# Altium schematic sheet DFP.SchDoc
size B; SheetNumber: 5; SheetTotal: 8
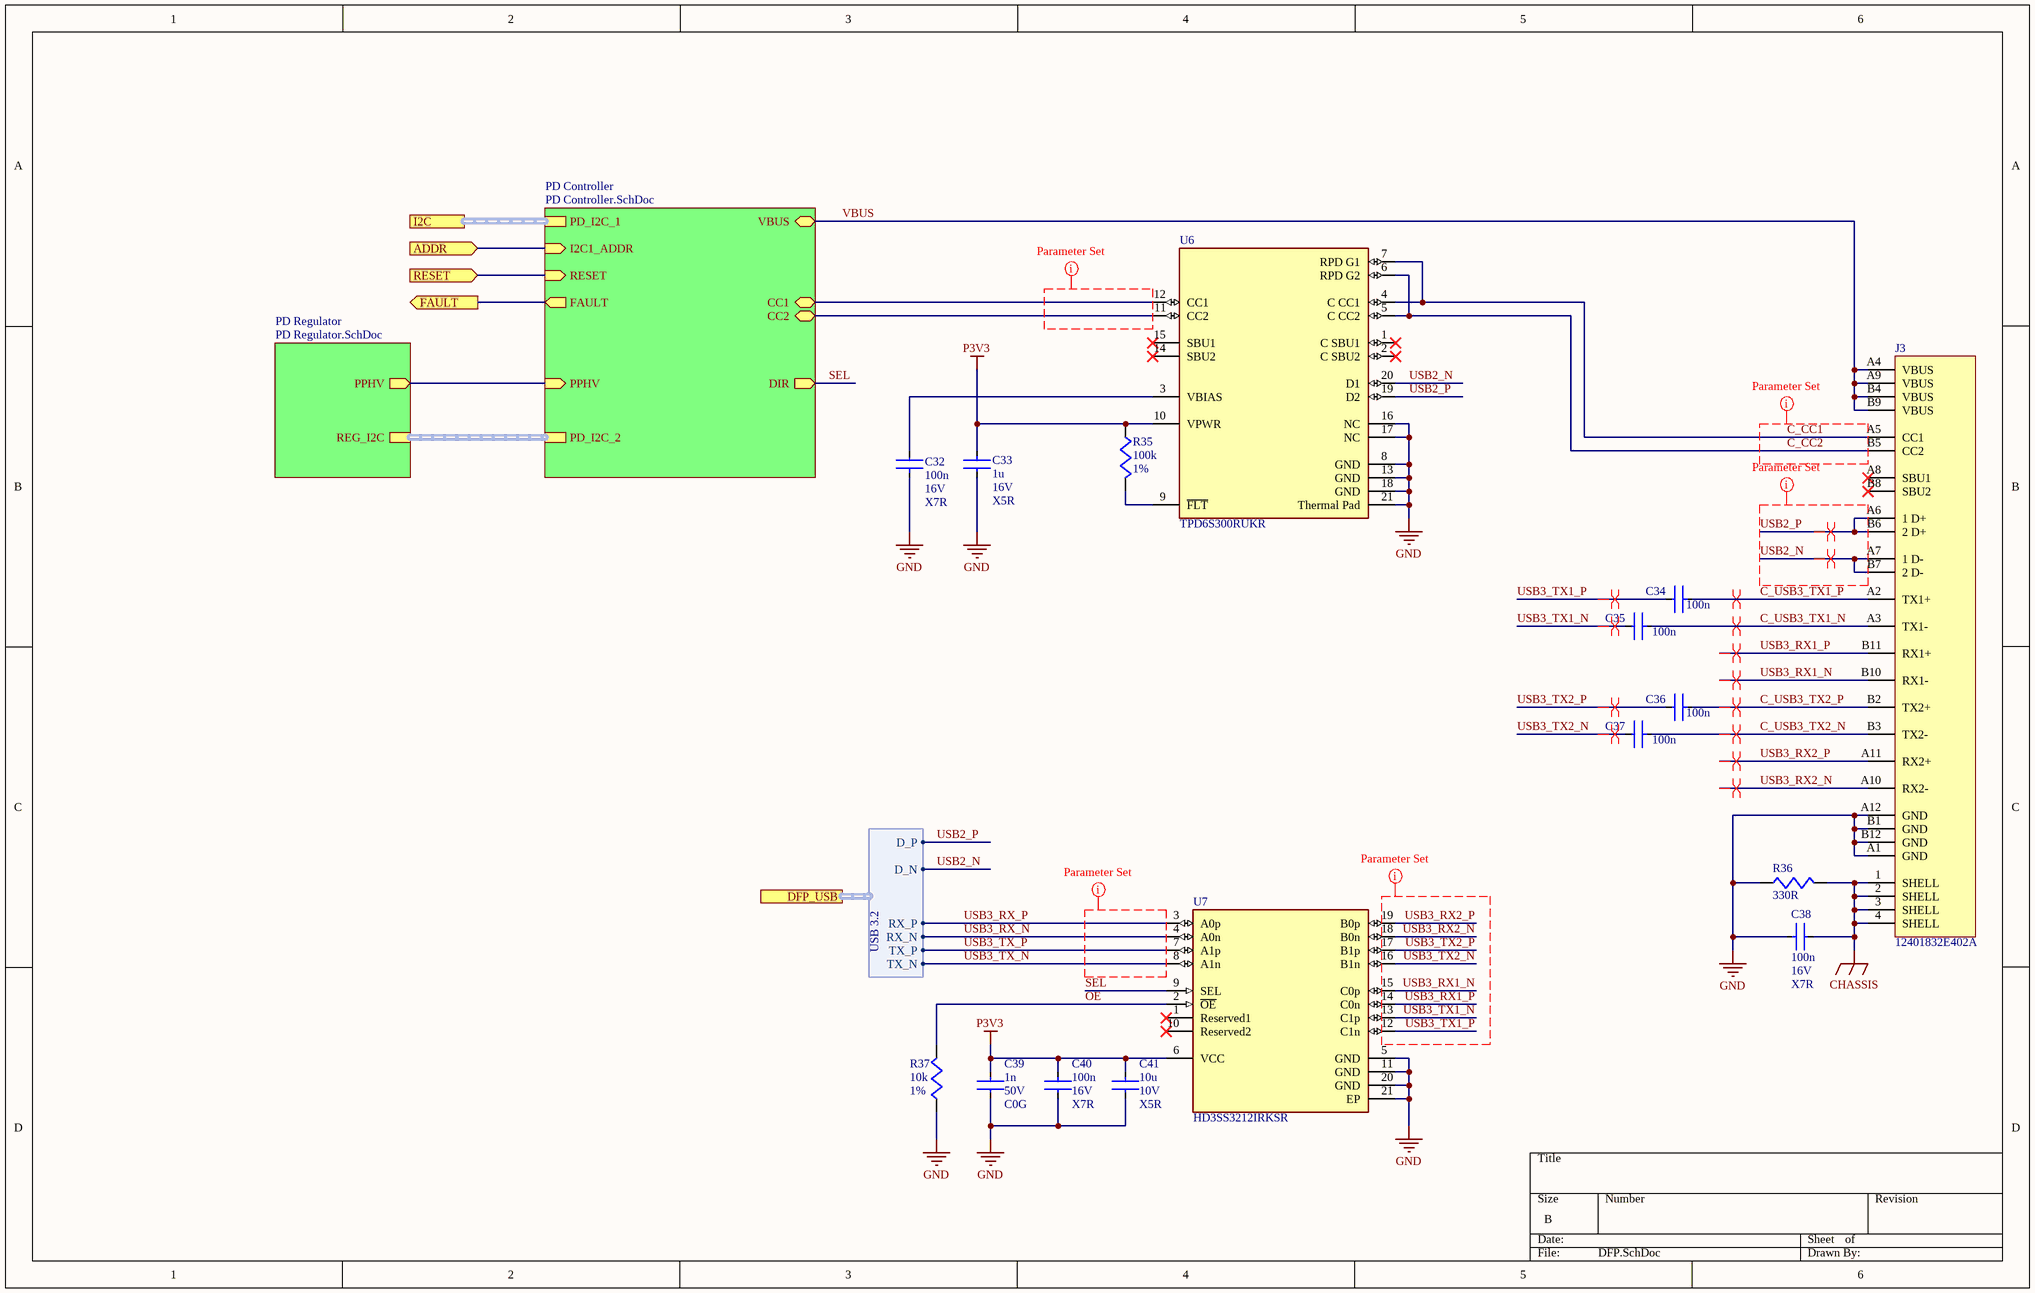
[diagram p0: DFP.SchDoc]

## Parts
C32  value 100n  Voltage: 16V  Dielectric: X7R  [CAPC1005X06N]  (hidden comment: 100nF 16V 0402)
C33  value 1u  Voltage: 16V  Dielectric: X5R  [CAPC1005X06N]  (hidden comment: 1uF 16V X5R 0402)
C34  value 100n  [CAPC0603X03N]  (hidden comment: 100nF 10V 0201)
C35  value 100n  [CAPC0603X03N]  (hidden comment: 100nF 10V 0201)
C36  value 100n  [CAPC0603X03N]  (hidden comment: 100nF 10V 0201)
C37  value 100n  [CAPC0603X03N]  (hidden comment: 100nF 10V 0201)
C38  value 100n  Voltage: 16V  Dielectric: X7R  [CAPC1005X06N]  (hidden comment: 100nF 16V 0402)
C39  value 1n  Voltage: 50V  Dielectric: C0G  [CAPC1608X08N]  (hidden comment: 1nF C0G 0603)
C40  value 100n  Voltage: 16V  Dielectric: X7R  [CAPC1005X06N]  (hidden comment: 100nF 16V 0402)
C41  value 10u  Voltage: 10V  Dielectric: X5R  [CAPC1005X06N]  (hidden comment: 10uF 10V 0402)
J3  12401832E402A  [FP-12401832E402A-MFG]
R35  value 100k  Tolerance: 1%  [RESC1005X04M]  (hidden comment: 100k 1% 0402)
R36  value 330R  [RESC1005X04M]  (hidden comment: 330R 1% 0402)
R37  value 10k  Tolerance: 1%  [RESC1005X04M]  (hidden comment: 10k 1% 0402)
U6  TPD6S300RUKR  [FP-RUK0020B-MFG]
U7  HD3SS3212IRKSR  [FP-RKS0020A-MFG]

## Sub-sheets
PD Controller = PD Controller.SchDoc: CC1 (bidir), CC2 (bidir), VBUS (bidir), PD_I2C_1 (harness i2C), PD_I2C_2 (harness I2C), I2C1_ADDR (in), PPHV (in), DIR (out), FAULT (out), RESET (in)
PD Regulator = PD Regulator.SchDoc: REG_I2C (harness I2C), PPHV (out)

## Ports
ADDR (in, see Main[4B]), DFP_USB (harness USB 3.2, see Main[3B]), FAULT (out, see Main[3B], PD Controller[2C]), I2C (harness I2C, see Main[3B]), RESET (in, see Main[3B], PD Controller[2C])

## Harnesses
USB 3.2: D_P, D_N, TX_P, TX_N, RX_P, RX_N

## Nets
CHASSIS: C38.2 J3.1(SHELL) J3.2(SHELL) J3.3(SHELL) J3.4(SHELL) R36.1
GND: C32.1 C33.2 C38.1 C39.2 C40.2 C41.2 J3.A1(GND) J3.A12(GND) J3.B1(GND) J3.B12(GND) R36.2 R37.1 U6.8(GND) U6.13(GND) U6.16(NC) U6.17(NC) U6.18(GND) U6.21(Thermal_Pad) U7.5(GND) U7.11(GND) U7.20(GND) U7.21(EP)
P3V3: C33.1 C39.1 C40.1 C41.1 R35.1 U6.10(VPWR) U7.6(VCC)
ADDR: port ADDR, sheet PD Controller/I2C1_ADDR
C_CC1: J3.A5(CC1) U6.4(C_CC1) U6.7(RPD_G1)
C_CC2: J3.B5(CC2) U6.5(C_CC2) U6.6(RPD_G2)
C_USB3_TX1_N: C35.1 J3.A3(TX1-)
C_USB3_TX1_P: C34.1 J3.A2(TX1+)
C_USB3_TX2_N: C37.1 J3.B3(TX2-)
C_USB3_TX2_P: C36.1 J3.B2(TX2+)
FAULT: port FAULT, sheet PD Controller/FAULT
OE: R37.2 U7.2(~{OE})
RESET: port RESET, sheet PD Controller/RESET
SEL: U7.9(SEL) ; sheet PD Controller/DIR
USB2_N: J3.A7(1_D-) J3.B7(2_D-) U6.20(D1) ; port DFP_USB.D_N
USB2_P: J3.A6(1_D+) J3.B6(2_D+) U6.19(D2) ; port DFP_USB.D_P
USB3_RX1_N: J3.B10(RX1-) U7.15(C0p)
USB3_RX1_P: J3.B11(RX1+) U7.14(C0n)
USB3_RX2_N: J3.A10(RX2-) U7.18(B0n)
USB3_RX2_P: J3.A11(RX2+) U7.19(B0p)
USB3_RX_N: U7.4(A0n) ; port DFP_USB.RX_N
USB3_RX_P: U7.3(A0p) ; port DFP_USB.RX_P
USB3_TX1_N: C35.2 U7.13(C1p)
USB3_TX1_P: C34.2 U7.12(C1n)
USB3_TX2_N: C37.2 U7.16(B1n)
USB3_TX2_P: C36.2 U7.17(B1p)
USB3_TX_N: U7.8(A1n) ; port DFP_USB.TX_N
USB3_TX_P: U7.7(A1p) ; port DFP_USB.TX_P
VBUS: J3.A4(VBUS) J3.A9(VBUS) J3.B4(VBUS) J3.B9(VBUS) ; sheet PD Controller/VBUS
NetC32_2: C32.2 U6.3(VBIAS)
NetR35_2: R35.2 U6.9(~{FLT})
NetU6_11: U6.11(CC2) ; sheet PD Controller/CC2
NetU6_12: U6.12(CC1) ; sheet PD Controller/CC1
(unnamed): sheet PD Controller/PPHV, sheet PD Regulator/PPHV

Not connected (* = marked no-connect by the designer): J3 A8(SBU1)* B8(SBU2)*; U6 1(C_SBU1)* 2(C_SBU2)* 14(SBU2)* 15(SBU1)*; U7 1(Reserved1)* 10(Reserved2)*

## Buses and harness runs
harness port I2C = sheet PD Controller/PD_I2C_1
harness sheet PD Controller/PD_I2C_2 = sheet PD Regulator/REG_I2C

## Layout directives
net class USB2: USB2_N, USB2_P
net class USB3: (no net found under the mark), USB3_RX1_N, USB3_RX1_P, USB3_RX2_N, USB3_RX2_P, USB3_TX1_N, USB3_TX1_P, USB3_TX2_N, USB3_TX2_P
differential pair; differential pair class DIFF90: C_USB3_TX1_N, C_USB3_TX1_P, C_USB3_TX2_N, C_USB3_TX2_P, USB2_N, USB2_P, USB3_RX1_N, USB3_RX1_P, USB3_RX2_N, USB3_RX2_P, USB3_TX1_N, USB3_TX1_P, USB3_TX2_N, USB3_TX2_P
net class CC: (no net found under the mark), C_CC1, C_CC2

## Library data of the parts
C32 C38 = CMP-001-00088-2: 16V 100nF X7R ±10% 0402 Multilayer Ceramic Capacitors MLCC - SMD/SMT ROHS; LCSC Part #: C1525; Package: 0402
C33 = CMP-001-00098-2: 16V 1uF X5R ±10% 0402 Multilayer Ceramic Capacitors MLCC - SMD/SMT ROHS; Package: 0402; LCSC Part #: C29266
C34-C37 = CMP-001-00107-2: 10V 100nF X5R ±10% 0201 Multilayer Ceramic Capacitors MLCC - SMD/SMT ROHS; Voltage: 10V; Dielectric: X5R; Package: 0402; LCSC Part #: C76934
C39 = CMP-001-00103-2: C0G 1nF 50V ±5% 0603 Multilayer Ceramic Capacitors MLCC - SMD/SMT ROHS; LCSC Part #: C342541; Package: 0603
C40 = CMP-001-00088-1: 16V 100nF X7R ±10% 0402 Multilayer Ceramic Capacitors MLCC - SMD/SMT ROHS; LCSC Part #: C1525; Package: 0402
C41 = CMP-001-00084-1: 10uF 10V 0402 20% X5R CAP MLCC; LCSC Part #: C527590; Footprint: 0402
J3 = CMP-002-00130-1: Conn USB Type C RCP 24 POS 0.25mm Solder RA SMD 24 Terminal 1 Port T/R; LCSC Part #: C464604
R35 = CMP-009-00218-2: 62.5mW Thick Film Resistors 50V ±100ppm/℃ ±1% 100kΩ 0402 Chip Resistor - Surface Mount ROHS; Package: 0402; LCSC Part #: C60491
R36 = CMP-009-00201-3: 62.5mW Thick Film Resistors 50V ±100ppm/℃ ±1% 330Ω 0402 Chip Resistor - Surface Mount ROHS; Tolerance: 1%; LCSC Part #: C105875; Package: 0402
R37 = CMP-009-00187-1: 62.5mW Thick Film Resistors 50V ±100ppm/℃ ±1% 10kΩ 0402 Chip Resistor - Surface Mount ROHS; LCSC Part #: C60490; Package: 0402
U6 = CMP-019-00064-3: WQFN-20-EP(3x3) ESD and Surge Protection (TVS/ESD) ROHS; Package: WQFN-20-EP; LCSC Part #: C2649810
U7 = CMP-001-0010-5: 2-channel 10-Gbps 2: 1/1: 2 USB 3.1 differential mux/demux 20-VQFN -40 to 85; Number of Channels: 2; Min Supply Voltage: 3V; Data Rate: 480Mbps; -3db Bandwidth: 8GHz; Max Supply Voltage: 3.6V; USB Standard: USB 3.1; Nominal Supply Current: 600uA; Max Operating Temperature: 85°C; Pins: 20; Packaging: Cut Tape; Min Operating Temperature: -40°C; Height: 1mm; Length: 4.5mm; Number of Ports: 2; Mounting Technology: Surface Mount; Width: 2.5mm; Interface: USB; Case/Package: VQFN; Reach SVHC Compliant: No; Series: -; Lead Free: Lead Free; Thickness: 900um